# EAGLE design Adafruit Metro M0 Express (EAGLE 6.4)
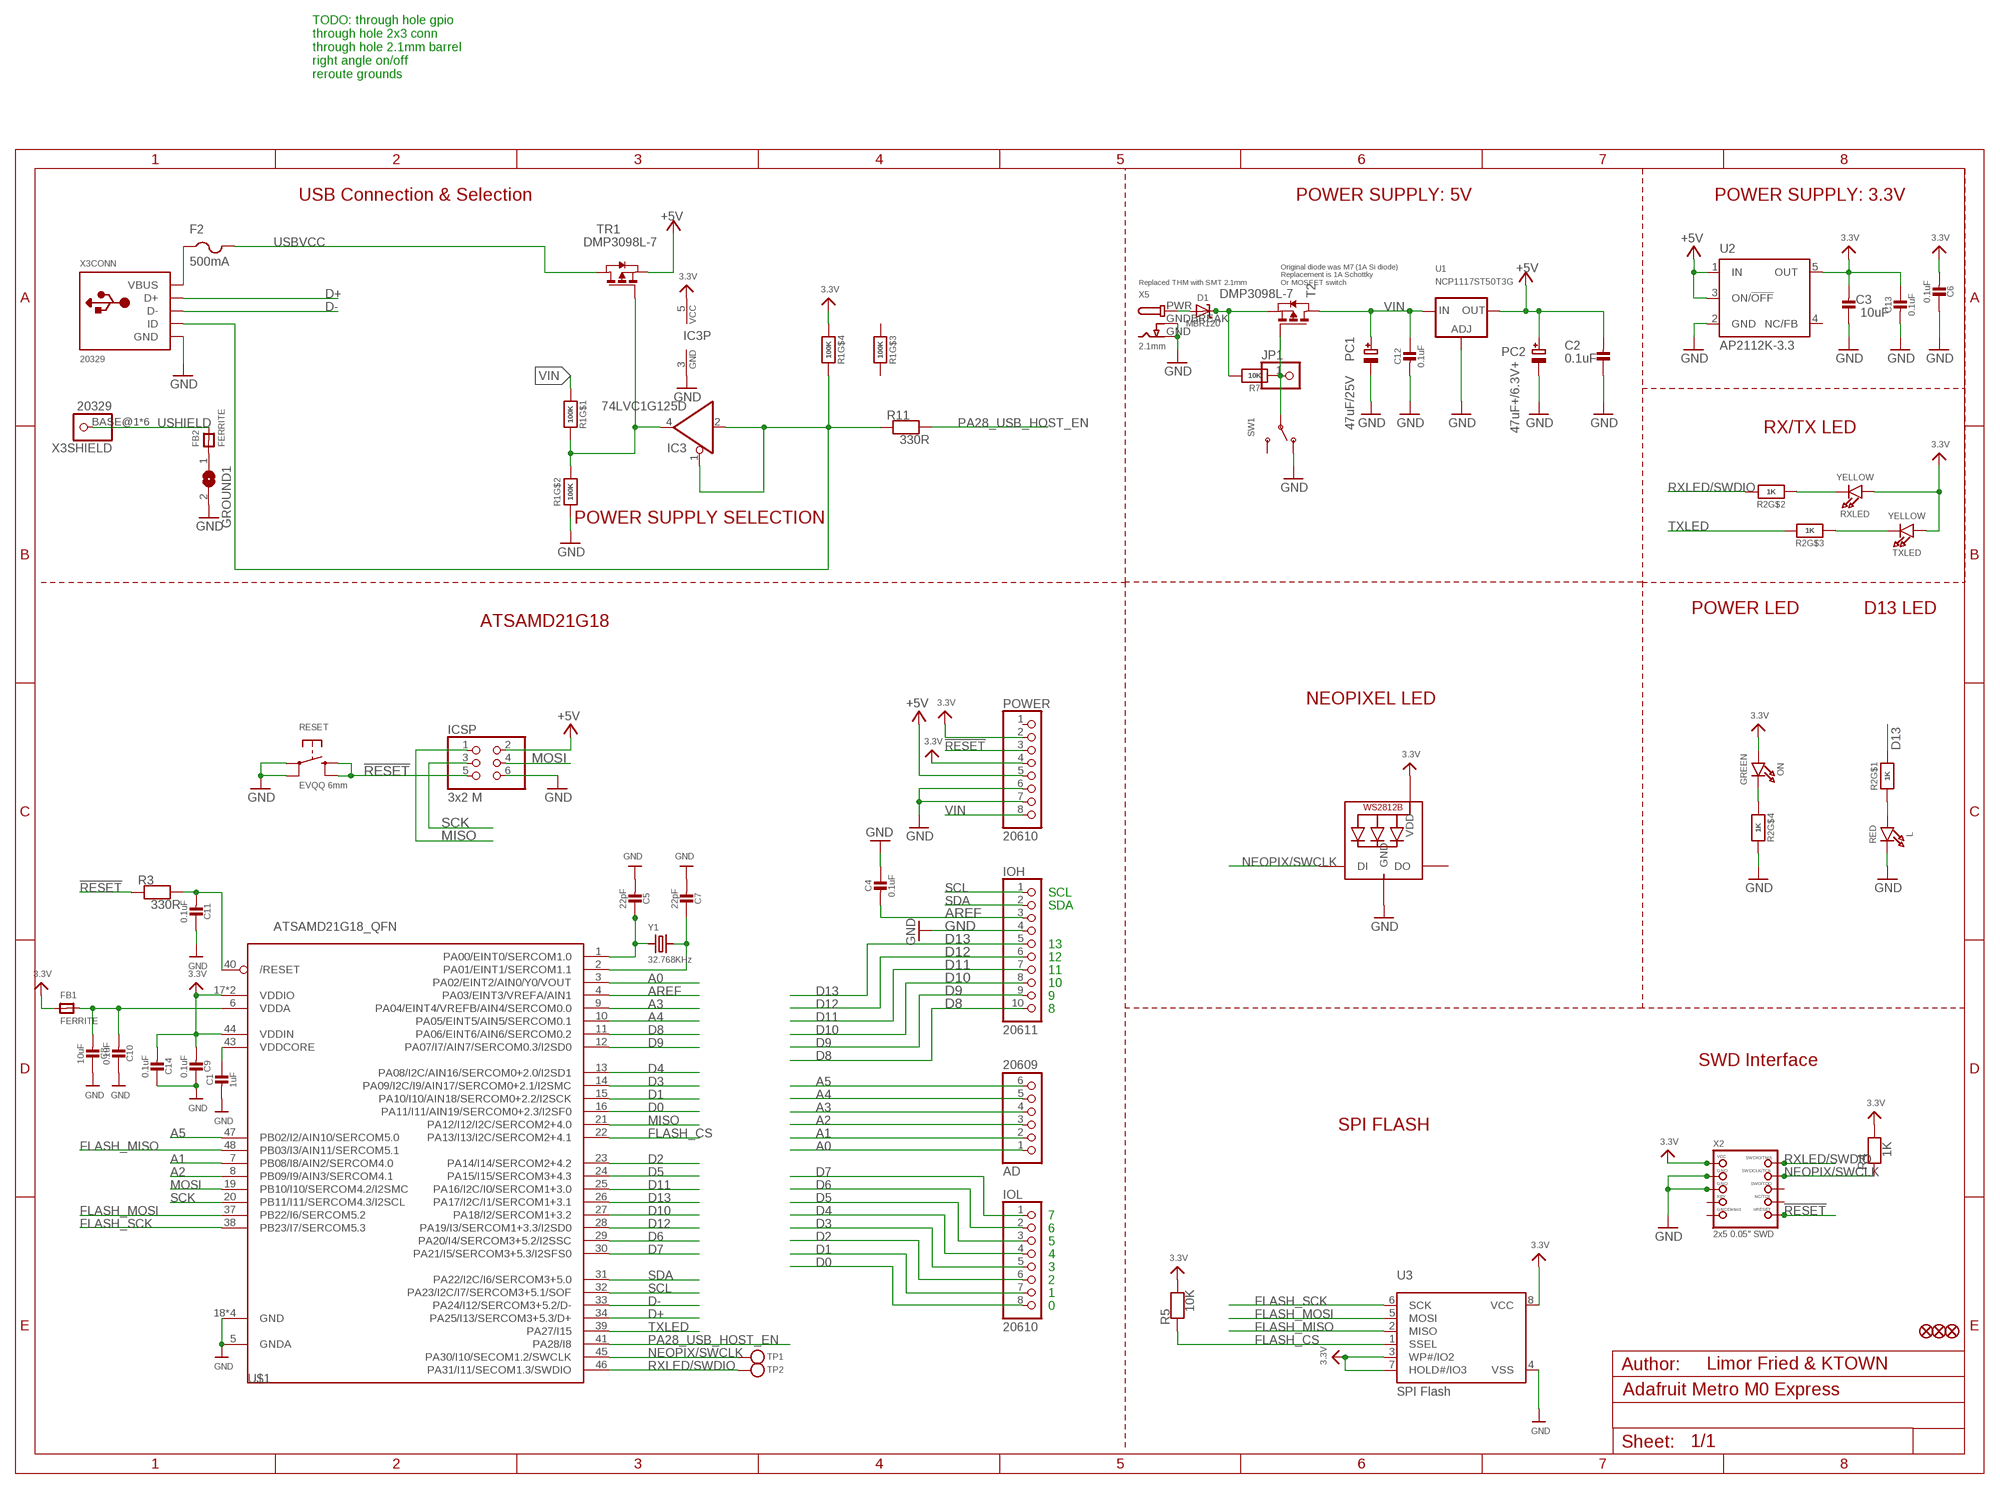
[diagram p0: schematic, sheet 1]

## Parts
AD  20609  HEADER-1X6OVALWAVE  [1X06_OVALWAVE]
C1  1uF  CAP_CERAMIC0805-NOOUTLINE  [0805-NO]
C2  0.1uF  CAP_CERAMIC0805-NOOUTLINE  [0805-NO]
C3  10uF  CAP_CERAMIC0805-NOOUTLINE  [0805-NO]
C4  0.1uF  CAP_CERAMIC0805-NOOUTLINE  [0805-NO]
C5  22pF  CAP_CERAMIC0805-NOOUTLINE  [0805-NO]
C6  0.1uF  CAP_CERAMIC0805-NOOUTLINE  [0805-NO]
C7  22pF  CAP_CERAMIC0805-NOOUTLINE  [0805-NO]
C8  10uF  CAP_CERAMIC0805-NOOUTLINE  [0805-NO]
C9  0.1uF  CAP_CERAMIC0805-NOOUTLINE  [0805-NO]
C10  0.1uF  CAP_CERAMIC0805-NOOUTLINE  [0805-NO]
C11  0.1uF  CAP_CERAMIC0805-NOOUTLINE  [0805-NO]
C12  0.1uF  CAP_CERAMIC0805-NOOUTLINE  [0805-NO]
C13  0.1uF  CAP_CERAMIC0805-NOOUTLINE  [0805-NO]
C14  0.1uF  CAP_CERAMIC0805-NOOUTLINE  [0805-NO]
D1  MBR120  DIODE-SCHOTTKYSOD-123  [SOD-123]
F2  500mA  PTCFUSE-1206  [R1206]
FB1  FERRITE  FERRITE-0805NO  [0805-NO]
FB2  FERRITE  FERRITE-0805NO  [0805-NO]
FD1  FIDUCIAL_1MM  [FIDUCIAL_1MM]
FD2  FIDUCIAL_1MM  [FIDUCIAL_1MM]
FD3  FIDUCIAL_1MM  [FIDUCIAL_1MM]
GROUND1  SJ  [SJ]
IC3  74LVC1G125D  74AHC1G125DBV  [SOT23-5]
ICSP  3x2 M  HEADER-2X3  [2X03_ROUND_70MIL]
IOH  20611  HEADER-1X10OVALWAVE  [1X10_OVALWAVE]
IOL  20610  HEADER-1X8OVALWAVE  [1X08_OVALWAVE]
JP1  HEADER-1X1ROUND  [1X01_ROUND]
L  RED  LED0805_NOOUTLINE  [CHIPLED_0805_NOOUTLINE]
LED1  WS2812B3535  [LED3535]
ON  GREEN  LED0805_NOOUTLINE  [CHIPLED_0805_NOOUTLINE]
PC1  47uF/25V  CAP_ELECTROLYTICPANASONIC_D  [PANASONIC_D]
PC2  47uF+/6.3V+  CAP_ELECTROLYTICPANASONIC_D  [PANASONIC_D]
POWER  20610  HEADER-1X8OVALWAVE  [1X08_OVALWAVE]
R1  100K  RESISTOR_4PACK  [RESPACK_4X0603]
R2  1K  RESISTOR_4PACK  [RESPACK_4X0603]
R3  330R  RESISTOR0805_NOOUTLINE  [0805-NO]
R4  1K  RESISTOR0805_NOOUTLINE  [0805-NO]
R5  10K  RESISTOR0805_NOOUTLINE  [0805-NO]
R7  10K  RESISTOR0805_NOOUTLINE  [0805-NO]
R11  330R  RESISTOR0805_NOOUTLINE  [0805-NO]
RESET  EVQQ 6mm  SWITCH_TACT_SMT  [EVQ-Q2]
RXLED  YELLOW  LED0805_NOOUTLINE  [CHIPLED_0805_NOOUTLINE]
SW1  SWITCH_SPDT  [SPDT_SMT_SSSS811101]
T2  DMP3098L-7  PMOSSOT23  [SOT-23]
TP1  TESTPOINTROUND1.5MM  [TESTPOINT_ROUND_1.5MM]
TP2  TESTPOINTROUND1.5MM  [TESTPOINT_ROUND_1.5MM]
TR1  DMP3098L-7  0297_PMV48XP  [SOT-23]
TXLED  YELLOW  LED0805_NOOUTLINE  [CHIPLED_0805_NOOUTLINE]
U1  NCP1117ST50T3G  LM1117SOT223-REFLOW  [SOT223-R]
U2  AP2112K-3.3  LP2985-XXDBVR33  [SOT23-DBV]
U3  SPI Flash  SPIFLASH_SOIC8208MIL  [SOIC8_208MIL]
U$1  ATSAMD21G18_QFN  ATSAMD21J_QFN  [TQFN48_7MM]
X2  2x5 0.05" SWD  JTAG-CORTEXBOXPOSTS  [2X05_1.27MM_BOX_POSTS]
X3  20329  USB_W_SHIELD_V2  [4UCONN_20329_V2]
X5  2.1mm  DCBARRELPTH  [DCJACK_2MM_PTH]
Y1  32.768KHz  CRYSTAL8.0X3.8  [CRYSTAL_8X3.8]

## Nets
3.3V: C3.2 C6.2 C9.2 C13.1 C14.2 FB1.1 IC3.5(VCC) LED1.2(VDD) ON.A POWER.2 POWER.4 R1.4 R4.2 R5.2 RXLED.A TXLED.A U2.5(OUT) U3.3(WP#/IO2) U3.7(HOLD#/IO3) U3.8(VCC) U$1.17(VDDIO) U$1.36(VDDIO) U$1.44(VDDIN) X2.1(VCC)
!RESET: ICSP.5 POWER.3 R3.1 RESET.B'(S1) RESET.B(S) X2.10(NRESET)
+5V [usbvcc]: C2.2 ICSP.2 PC2.+ POWER.5 TR1.2(S) U1.2(OUT) U1.4(OUT) U2.1(IN) U2.3(ON/!OFF)
A0: AD.1 U$1.3(PA02/EINT2/AIN0/Y0/VOUT)
A1: AD.2 U$1.7(PB08/I8/AIN2/SERCOM4.0)
A2: AD.3 U$1.8(PB09/I9/AIN3/SERCOM4.1)
A3: AD.4 U$1.9(PA04/EINT4/VREFB/AIN4/SERCOM0.0)
A4: AD.5 U$1.10(PA05/EINT5/AIN5/SERCOM0.1)
A5: AD.6 U$1.47(PB02/I2/AIN10/SERCOM5.0)
AREF [aref]: C4.2 IOH.3 U$1.4(PA03/EINT3/VREFA/AIN1)
AVCC: C8.2 C10.2 FB1.2 U$1.6(VDDA)
D0: IOL.8 U$1.16(PA11/I11/AIN19/SERCOM0+2.3/I2SF0)
D1: IOL.7 U$1.15(PA10/I10/AIN18/SERCOM0+2.2/I2SCK)
D2: IOL.6 U$1.23(PA14/I14/SERCOM2+4.2)
D3: IOL.5 U$1.14(PA09/I2C/I9/AIN17/SERCOM0+2.1/I2SMC)
D4: IOL.4 U$1.13(PA08/I2C/AIN16/SERCOM0+2.0/I2SD1)
D5: IOL.3 U$1.24(PA15/I15/SERCOM3+4.3)
D6: IOL.2 U$1.29(PA20/I4/SERCOM3+5.2/I2SSC)
D7: IOL.1 U$1.30(PA21/I5/SERCOM3+5.3/I2SFS0)
D8: IOH.10 U$1.11(PA06/EINT6/AIN6/SERCOM0.2)
D9: IOH.9 U$1.12(PA07/I7/AIN7/SERCOM0.3/I2SD0)
D10: IOH.8 U$1.27(PA18/I2/SERCOM1+3.2)
D11: IOH.7 U$1.25(PA16/I2C/I0/SERCOM1+3.0)
D12: IOH.6 U$1.28(PA19/I3/SERCOM1+3.3/I2SD0)
D13: IOH.5 R2.8 U$1.26(PA17/I2C/I1/SERCOM1+3.1)
D+: U$1.34(PA25/I13/SERCOM3+5.3/D+) X3.D+(CONN:D+)
D-: U$1.33(PA24/I12/SERCOM3+5.2/D-) X3.D-(CONN:D-)
FLASH_CS: R5.1 U3.1(SSEL) U$1.22(PA13/I13/I2C/SERCOM2+4.1)
FLASH_MISO: U3.2(MISO) U$1.48(PB03/I3/AIN11/SERCOM5.1)
FLASH_MOSI: U3.5(MOSI) U$1.37(PB22/I6/SERCOM5.2)
FLASH_SCK: U3.6(SCK) U$1.38(PB23/I7/SERCOM5.3)
GND [gnd]: C1.2 C2.1 C3.1 C4.1 C5.2 C6.1 C7.2 C8.1 C9.1 C10.1 C11.1 C12.2 C13.2 C14.1 GROUND1.2 IC3.3(GND) ICSP.6 IOH.4 L.C LED1.4(GND) PC1.- PC2.- POWER.6 POWER.7 R1.2 R2.5 RESET.A'(P1) RESET.A(P) SW1.A(O) U1.1(ADJ) U2.2(GND) U3.4(VSS) U$1.5(GNDA) U$1.18(GND) U$1.35(GND) U$1.42(GND) U$1.THERMAL(GND) X2.3(GND) X2.5(GND) X3.GND(CONN:GND) X5.GND X5.GNDBREAK
MISO: ICSP.1 U$1.21(PA12/I12/I2C/SERCOM2+4.0)
MOSI: ICSP.4 U$1.19(PB10/I10/SERCOM4.2/I2SMC)
N$1: L.A R2.1
N$2: FB2.1 GROUND1.1
N$3: ON.C R2.4
N$4: C5.1 U$1.1(PA00/EINT0/SERCOM1.0) Y1.P$1
N$5: R2.2 RXLED.C
N$6: C7.1 U$1.2(PA01/EINT1/SERCOM1.1) Y1.P$4
N$7: R2.3 TXLED.C
N$8: C11.2 R3.2 U$1.40(/RESET)
N$9: D1.A X5.PWR
N$10: IC3.1(OE) IC3.2(I) R1.5 R11.1 X3.ID(CONN:ID)
N$11: IC3.4(O) R1.7 R1.8 TR1.3(G)
N$13: JP1.1 R7.1 SW1.B(P) T2.3(G)
N$15: D1.C R7.2 T2.2(S)
NEOPIX/SWCLK: LED1.1(DI) R4.1 TP1.P$1 U$1.45(PA30/I10/SECOM1.2/SWCLK) X2.4(SWDCLK)
PA28_USB_HOST_EN: R11.2 U$1.41(PA28/I8)
RXLED/SWDIO: R2.7 TP2.P$1 U$1.46(PA31/I11/SECOM1.3/SWDIO) X2.2(SWDIO)
SCK: ICSP.3 U$1.20(PB11/I11/SERCOM4.3/I2SCL)
SCL: IOH.1 U$1.32(PA23/I2C/I7/SERCOM3+5.1/SOF)
SDA: IOH.2 U$1.31(PA22/I2C/I6/SERCOM3+5.0)
TXLED: R2.6 U$1.39(PA27/I15)
USBVCC [usbvcc]: F2.2 TR1.1(D)
USHIELD [gnd]: FB2.2 X3.BASE@1 X3.BASE@2 X3.SPRT@1 X3.SPRT@2 X3.SPRT@3 X3.SPRT@4
VBUS: F2.1 X3.VBUS(CONN:VBUS)
VDDCORE: C1.1 U$1.43(VDDCORE)
VIN [USB]: C12.1 PC1.+ POWER.8 R1.1 T2.1(D) U1.3(IN)
Unconnected: LED1.3(DO) POWER.1 R1.3 R1.6 SW1.C(S) U2.4(NC/FB) X2.6(SWO) X2.7(KEY) X2.8(TDI) X2.9(GNDDETECT)

## Notes on the sheet
- TODO: through hole gpio
  through hole 2x3 conn
  through hole 2.1mm barrel
  right angle on/off
  reroute grounds
- USB Connection & Selection | POWER SUPPLY: 5V | POWER SUPPLY: 3.3V
- Replaced THM with SMT 2.1mm
- Original diode was M7 (1A Si diode)
  Replacement is 1A Schottky
  Or MOSFET switch
- RX/TX LED
- POWER SUPPLY SELECTION
- POWER LED | D13 LED
- ATSAMD21G18
- NEOPIXEL LED
- SCL
- SDA
- 13
- 12
- 11
- 10
- 9
- 8
- SWD Interface
- SPI FLASH
- 7
- 6
- 5
- 4
- 3
- 2
- 1
- 0
- Limor Fried & KTOWN

## Library data of the parts
AD = microbuilder:HEADER-1X6: PIN HEADER
C1-C14 = microbuilder:CAP_CERAMIC: Ceramic Capacitors For new designs, use the packages preceded by an '_' character since they are more reliable: The following footprints should be used on most boards: _0402 - Standard footprint for regular board layouts _0603 - Standard footprint for regular board layouts _0805 - Standard footprint for regular board layouts _1206 - Standard footprint for regular board layouts For extremely tight-pitch boards where space is at a premium, the following 'micro-pitch' footprints can be used (smaller pads, no silkscreen outline, etc.): _0402MP - Micro-pitch footprint for very dense/compact boards _0603MP - Micro-pitch footprint for very dense/compact boards _0805MP - Micro-pitch footprint for very dense/compact boards _1206MP - Micro-pitch footprint for very dense/compact boards
D1 = microbuilder:DIODE-SCHOTTKY
F2 = adafruit:PTCFUSE: PTC fuses, resettable thermistors
FB1 FB2 = microbuilder:FERRITE: Ferrite Bead 0603 MMZ1608B121C - 120 Ohm @ 100MHz, 600mA, 0.15 Ohm DC Resistance - Digikey: 445-2164-1-ND BK1608HW121-T - 120 Ohm, 600mA Ferrite Chip - Digikey: 587-1876-2-ND 0805 HZ0805B272R-10 - 2.7K Ohm @ 100MHz, 200mA, 0.8 Ohm DC Resistance - Digikey: 240-2504-1-ND (see also Murata BLM21BD272SN1L) MMZ2012Y152B - 1.5K Ohm @ 100MHz, 500mA, 0.4 Ohm DC Resistance - Digikey: 445-1560-1-ND - Mainly for high frequency (80-400MHz) MMZ2012R102A - 1K Ohm @ 100MHz, 500mA, 0.3 Ohm DC Resistance - Digikey: 445-1555-2-ND - More general purpose (10-200MHz)
FD1-FD3 = microbuilder:FIDUCIAL: Fiducial Alignment Points Various fiducial points for machine vision alignment.; BOM: EXCLUDE
GROUND1 = jumper:SJ: SMD solder JUMPER
IC3 = 74xx-little-de:74*1G125: Single Bus Buffer Gate with 3-State Output
ICSP = microbuilder:HEADER-2X3: PIN HEADER
IOH = microbuilder:HEADER-1X10: PIN HEADER
IOL POWER = microbuilder:HEADER-1X8: PIN HEADER
JP1 = microbuilder:HEADER-1X1: PIN HEADER
L ON RXLED TXLED = microbuilder:LED: LED 0603 - 0603 Surface Mount Package 2mA: Green LED - Low Power (3.9mcd, 2ma, 1.7Vf) - Digikey: 475-2709-2-ND Orange LED - Low Power (9.8mcd, 2ma, 1.8Vf) - Digikey: 475-1194-2-ND Red LED - Low Power (5mcd, 2ma, 1.8Vf) - Digikey: 475-1195-2-ND Yellow LED - Low Power (7mcd, 2ma, 1.8Vf) - Digikey: 475-1196-2-ND 5mA: Blue LED - Low Power (17mcd, 5ma, 2.9Vf) - Digikey: LNJ937W8CRACT-ND 0805 - 0805 Surface Mount Package 2mA: Red LED (8.8mcd, 2mA, 1.8Vf, Clear) - Low Power [Digikey: 475-2510-1-ND] Green LED (5mcd, 2mA, 1.8Vf, Clear) - Low Power [Digikey: 475-2730-1-ND] Yellow LED (11.3mcd, 2mA, 1.8Vf, Clear) - Low Power [Digikey: 475-2555-1-ND] 20mA: Red LED (104mcd, 20mA, Diffused) - LS R976 [Digikey: 475-1278-6-ND] Red LED (12mcd, 20mA, 2.0Vf, Clear) - APT2012EC [Digikey: 754-1128-1-ND] Green LED (15mcd, 20mA, 2.2Vf, Clear) - APT2012GC [Digikey: 754-1131-1-ND] Orange LED (160mcd, 20mA, 2.1Vf, Clear) - APT2012SECK [Digikey: 754-1130-1-ND] 1206 - 1206 Surface Mount Package Green LED (26mcd, 20mA, Diffused) - LG N971 [Digikey: 475-1407-6-ND] Red LED (15mcd, 20mA, Diffused) - LH N974 [Digikey: 475-1416-6-ND] Cree - Cree High-Power Surface Mount LEDs XPEBWT-L1-0000-00D50 - White 111lm 350mA 2.9Vf 6200K 110° XTEAWT-00-0000-00000LEE3 - White 114lm 350mA 2.85Vf 5000K 115° Everlight - Everlight 45-21 Series Surface Mount LEDs 45-21/QK2C-B2832AC2CB2/2T - Warm White 2000mcd 20mA 3.25Vf 3050K 120° 45-21/LK2C-B38452C4CB2/2T - Nuetral White 2000mcd 20mA 3.25Vf 4150K 120° 45-21/LK2C-B50634C6CB2/2T - Cold White 2200mcd 20mA 3.25Vf 5650K 120° PLCC2 Reverse Mount LS T77K-J1L2-1-0-2-R18-Z - Red 11.25mcd 2mA 1.8Vf 630nm 120° LO T77K-L1M2-24-Z - Orange 19.6mcd 2mA 1.8Vf 606nm 120° LY T77K-K2M1-26-Z - Yellow 15.7mcd 2mA 1.8Vf 587nm 120°
LED1 = microbuilder:WS2812B
PC1 PC2 = microbuilder:CAP_ELECTROLYTIC: Electrolytic Capacitors SMT PANASONIC_C - Size C Panasonic Electrolytic Aluminum Capacitor 47µF 16V 20% Electrolytic Capacitor [Digikey: PCE3890TR-ND] PANASONIC_D - Size D Panasonic Electrolytic Aluminum Capacitor 100µF 25V 20% Electrolytic Capacitor [Digikey: PCE3898TR-ND] PTH 3.5 mm grid, 8 mm diameter ... 3.5 mm grid, 10 mm diameter ...
R1 R2 = microbuilder:RESISTOR_4PACK: Resistor Packs (4 resistors) 4 x 0603 10K 1/16W - Digikey: YC164J-10KCT-ND
R3-R5 R7 R11 = microbuilder:RESISTOR: Resistors For new designs, use the packages preceded by an '_' character since they are more reliable: The following footprints should be used on most boards: _0402 - Standard footprint for regular board layouts _0603 - Standard footprint for regular board layouts _0805 - Standard footprint for regular board layouts _1206 - Standard footprint for regular board layouts For extremely tight-pitch boards where space is at a premium, the following 'micro-pitch' footprints can be used (smaller pads, no silkscreen outline, etc.): _0402MP - Micro-pitch footprint for very dense/compact boards _0603MP - Micro-pitch footprint for very dense/compact boards _0805MP - Micro-pitch footprint for very dense/compact boards _1206MP - Micro-pitch footprint for very dense/compact boards
RESET = microbuilder:SWITCH_TACT_SMT: SMT Tact Switches 6x6mm - Digikey: P12940SCT-ND KMR2 (4.6x2.8mm) - Digikey: 401-1426-1-ND EVQ-PQHB55 - Light Touch, 160GF (4.5x4.5mm) - Digikey: P8090SCT-ND KMT0 - KMT021 NGJ LHS (etc.) IP68/Waterproof - Digikey: CKN10289CT-ND
SW1 = microbuilder:SWITCH_SPDT: Switch - SPDT SSSS811101 - Horizontal Two Position SMT, 0.3A 4V [Mouser: 688-SSSS811101]
T2 = zetex:PMOSSOT23: MOS FET; OC_FARNELL: unknown; OC_NEWARK: unknown
TP1 TP2 = microbuilder:TESTPOINT: Test Point Various test points for characterisation and PCB testing TESTPOINT_SMT - Compact Surface Mount Test Point [Digikey: 5016KTR-ND]
TR1 = Transistors:0297_PMV48XP: 20 V, 3.5 A P-channel Trench MOSFET - PMV48XP; CASE: SOT23; MONTHLY_USAGE: _____; PART_NUMBER: PMV48XP; PRICE: _____; SUPPLIER: _____; TYPE: Transistor; VALUE: PMV48XP
U1 = microbuilder:LM1117: LM1117 Voltage Regulator LM1117 Adjustable Voltage regulator [Digikey: LM1117IMP-ADJDKR-ND] LM1117 3.3V Voltage regulator [AP1117E33GDIDKR-ND] LM1117 5.0V Voltage regulator [AP1117E50GDIDKR-ND] SOT223-REFLOW - SOT223 package for solder paste/reflow ovens SOT223-WAVE - SOT223 package for hand-soldering (larger pads) Note: For the fixed-voltage regulators, simply set the ADJ pin to GND.
U2 = SmartPrj:LP2985-XXDBVR: ULTRALOW-POWER 50-mA LOW-DROPOUT LINEAR REGULATORS 50-mA Low-Dropout Regulator Source: http://focus.ti.com/lit/ds/symlink/tps77001.pdf
U3 = microbuilder:SPIFLASH_SOIC8: SOIC8 SPI Flash Be careful with the size since SOIC8 flash comes in several 'widths' SOIC8 150 mil M25P16 - 16Mbit (2Mbit x 8) Serial Flash (75MHz SPI Bus), Supply: 2.7-3.6V Digikey: SOIC8 - M25P16-VMN6P-ND SOIC8 208 mil W25Q16BVSSIG - 16Mbit (2Mbit x 8) Serial Flash (104MHz SPI Bus), Supply: 2.7-3.6V Digikey: SOIC8 - W25Q16BVSSIG-ND
U$1 = microbuilder:ATSAMD21J
X2 = microbuilder:JTAG-CORTEX: Serial Wire (SW-DP) Connector Standard 0.05" 10-pin connector is for use with the Cortex M and Cortex A SWD (serial wire debugger) interface (SW-DP) Connectors 2x05_1.27MM_SMT - Inexpensive surface-mount header with bare pins, compatible with standard 10-pin SWD cables (4UCON: 16846) 2x05_1.27MM_BOX_NOPOSTS - Polarised surface-mount box (4UCON with caps: 19735, without caps: 15117 2x05_1.27MM_BOX_POSTS - Polarised surface-mount box with mounting holes (4UCON: 20317) Pinout: http://infocenter.arm.com/help/topic/com.arm.doc.faqs/attached/13634/cortex_debug_connectors.pdf http://www.keil.com/peripherals/coresight/connectors.asp
X3 = microbuilder:USB_W_SHIELD
X5 = microbuilder:DCBARREL: DC Barrel Jack DCJACK_1.3MM_PTH - Through Hole 1.3mm Jack (4UConnector: 05536) DCJACK_2MM_PTH - Through Hole 2.0/2.1 Jack (4UConnector: 05537) DCJACK_2MM_SMT - SMT 2.0/2.1mm Jack(4UConnector: 03267)
Y1 = microbuilder:CRYSTAL: Crystals HC49UP - Surface Mount Crystal 4.0MHz 18pF +/-30ppm Surface Mount Crystal [Digikey: 535-9857-1-ND] 12.0 MHz Surface Mount Crystal [Digikey: 535-9869-6-ND] 25.0 MHz Surface Mount Crystal [Digikey: 535-9078-1-ND] 2.5 x 2.0mm - MEMs SMT Crystal 16.0 MHz 10pF 20ppm 2.5 x 2.0mm Crystal [Digikey -40-85°C: 535-10923-1-ND] 3.2 x 2.5mm - MEMs SMT Crystal 12.0 MHz 8pF 15ppm 3.2 x 2.5mm Crystal [Digikey: -10-70°C: 644-1047-1-ND -40-125°C: 644-1128-1-ND] 40~85°C cheaper: 644-1173-6-ND 16.0 MHz 8pF 15ppm 3.2 x 2.5mm Crystal [Digikey: -10-70°C: 644-1049-1-ND -40-125°C: 644-1129-2-ND]-40~85°C cheaper: 644-1175-6-ND 16.0 MHz 10pF 10ppm 3.2 x 2.5mm Crystal [Digikey: 644-1100-1-ND] 27.12 MHz 18pF 30ppm 3.2 x 2.5mm Crystal [Digikey: 887-1424-1-ND] 27.12MHz 10pF 10ppm 3.2 x 2.5mm Crystal [Digikey: 887-1329-1-ND] 4.9 x 1.8mm - MEMs SMT Crystal 32.768 KHz 12.5pF 20ppm 4.9 x 1.8mm Crystal [Digikey: SE2415CT-ND] 8.0 x 3.8mm - Surface Mount Crystal 32.768kHz 12.5pF 20ppm -40°C-85°C [Digikey: 535-9166-2-ND] Cylinder 32.768KHz Cylinder Crystal (2x6mm body) [Ex. Digikey: 300-8341-2-ND]

## Board
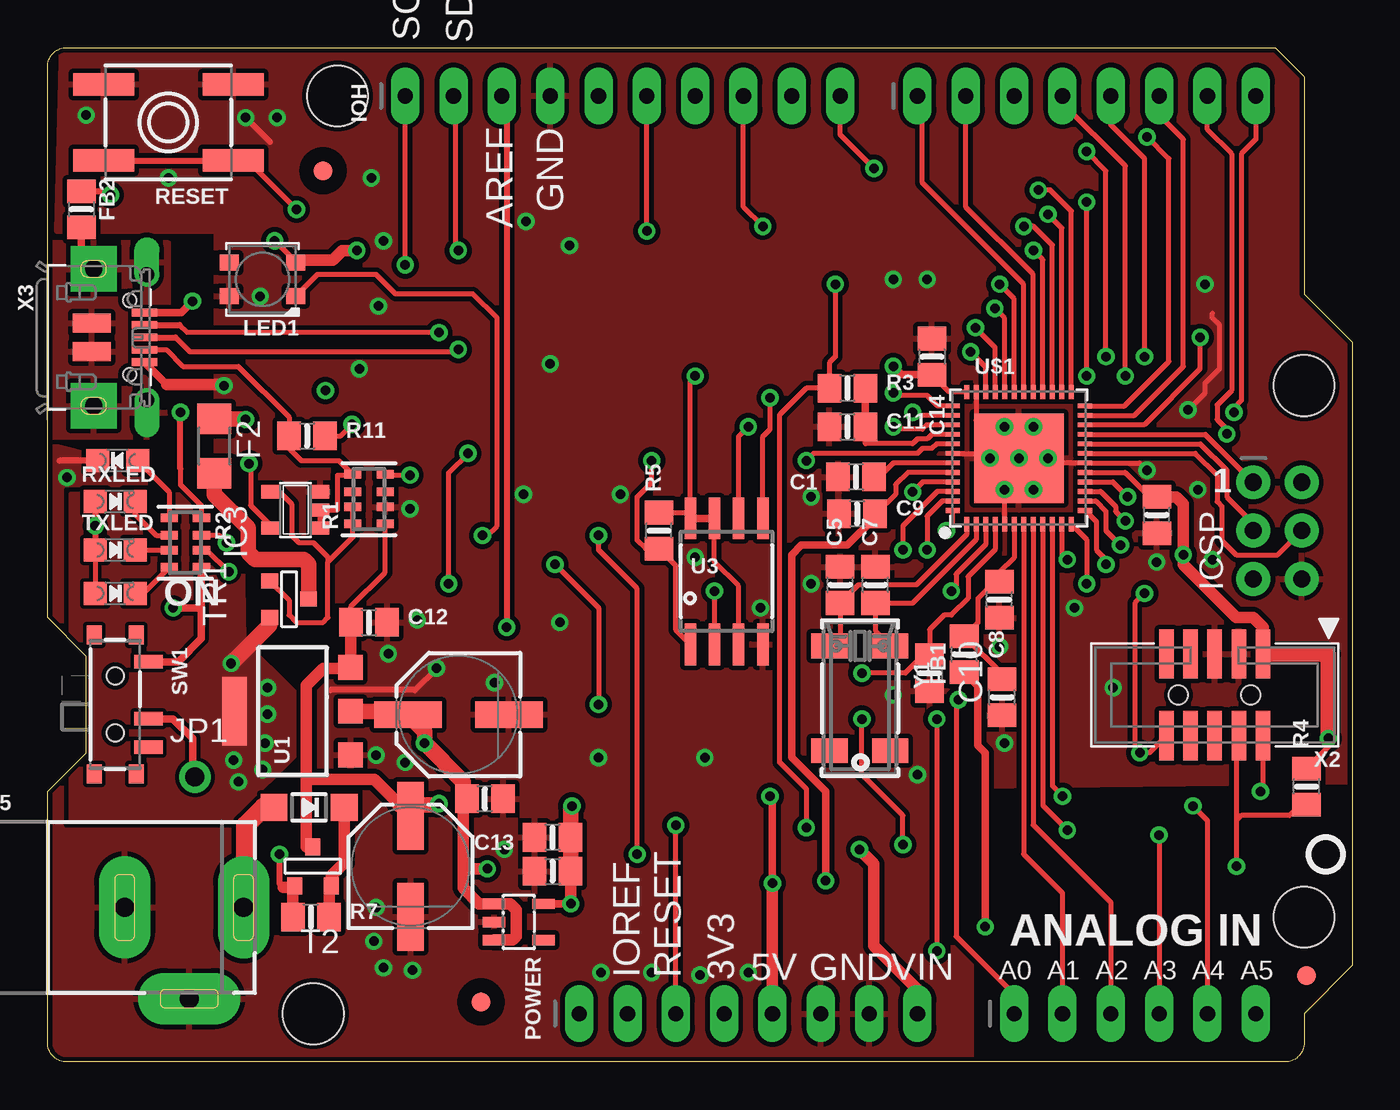
[diagram p1: board, top side]
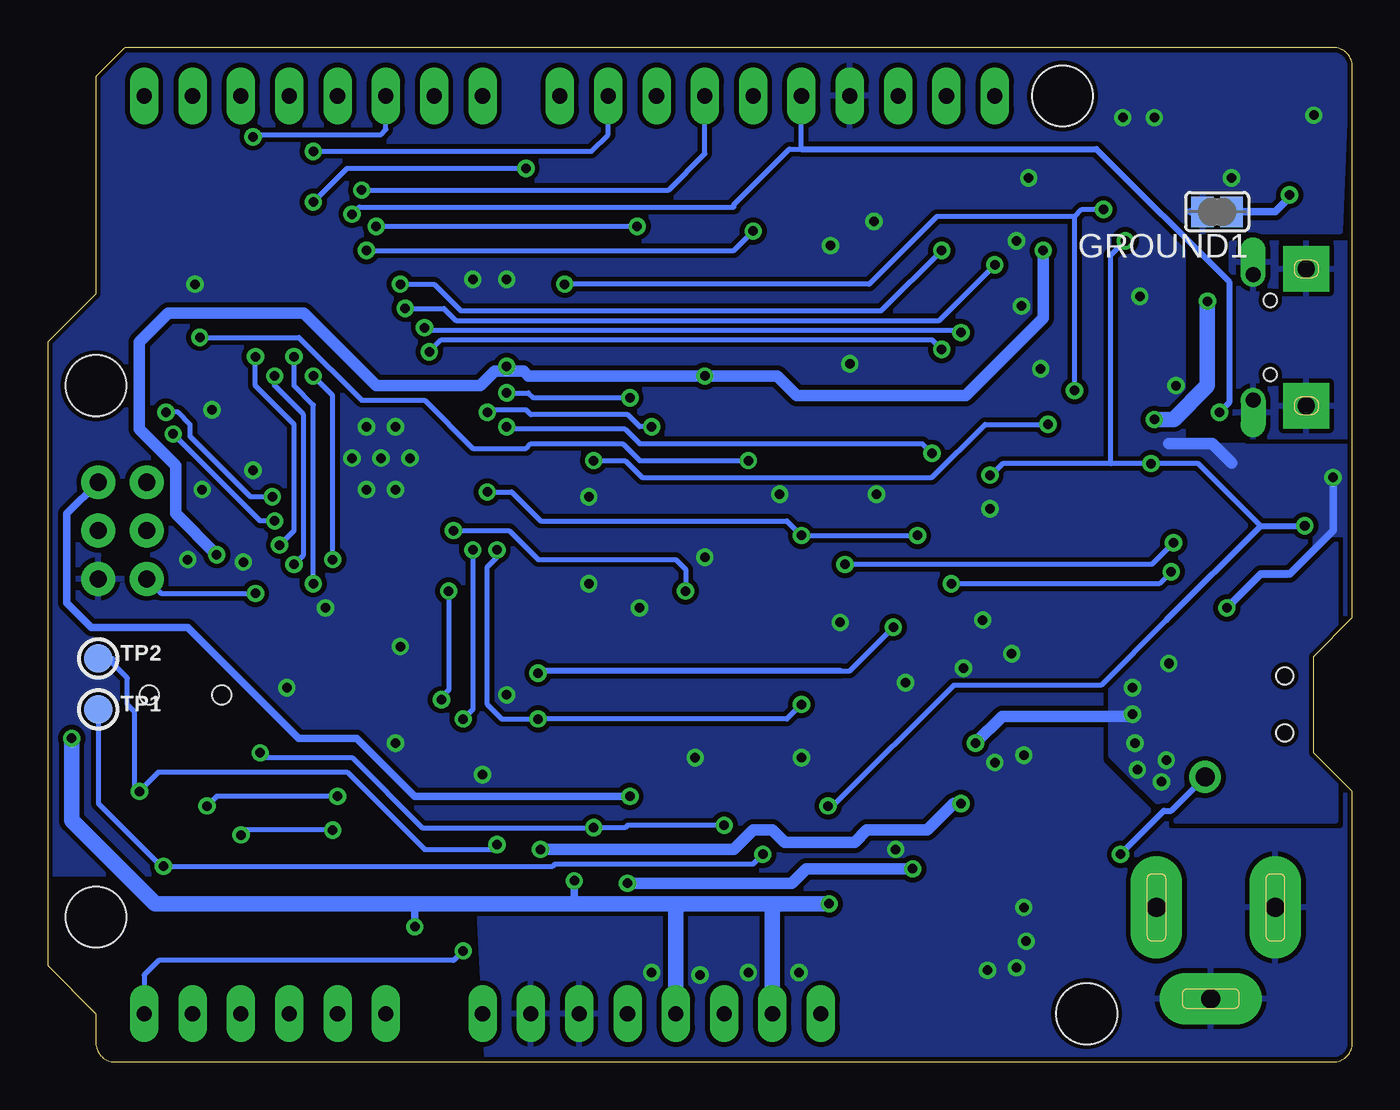
[diagram p2: board, bottom side, seen from below]

Size 68.58 x 53.34 mm. Coordinates in mm from the lower left corner, seen from the top.
Outline: 64.52,53.34 66.04,51.82 66.04,40.39 68.58,37.85 68.58,5.08 66.04,2.54 66.04,1 arc-90 65.04,0 1,0 arc-90 0,1 0,14.22 2.03,16.26 2.03,21.34 0,23.37 0,52.34 arc-90 1,53.34 64.52,53.34
Copper layers (1*16): Top 0.035mm / dielectric 1.5mm / Bottom 0.035mm
Design rules "adafruit *": minimum track width 8mil, minimum drill 15.5mil, track to track 8mil, track to pad 8mil, pad to pad 8mil, via to via 8mil, smd to smd 8mil, copper to edge 10mil, drill to drill 8mil, minimum pad ring 10mil, minimum via ring 8mil, stop-mask expansion 2mil, vias tented up to drill 20mil, thermal gap 10mil
Holes 3.2 mm at 66.04,35.56 66.04,7.62 15.24,50.8 13.97,2.54

### Footprints (pad centres in the part's own frame; a part is rotated, then mirrored left to right if it is on the bottom)
1X06_OVALWAVE = drill 0.8 pad 1.5 long: 1 -6.35,0; 2 -3.81,0; 3 -1.27,0; 4 1.27,0; 5 3.81,0; 6 6.35,0
0805-NO = smd 1.24 x 1.5: 1 -0.95,0; 2 0.95,0
SOD-123 = smd 1.4 x 1.4: A 1.85,0; C -1.85,0
R1206 = smd 1.6 x 1.803: 1 -1.422,0; 2 1.422,0
FIDUCIAL_1MM = smd 1 x 1: 1 0,0
SJ = smd 1.168 x 1.6: 1 -0.762,0; 2 0.762,0
SOT23-5 = smd 0.69 x 0.99: 1 -0.95,-1.29; 2 0,-1.29; 3 0.95,-1.29; 4 0.95,1.3; 5 -0.95,1.3
2X03_ROUND_70MIL = drill 0.9 pad 1.778: 1 -2.54,-1.27; 2 -2.54,1.27; 3 0,-1.27; 4 0,1.27; 5 2.54,-1.27; 6 2.54,1.27
1X10_OVALWAVE = drill 0.8 pad 1.5 long: 1 -11.43,0; 2 -8.89,0; 3 -6.35,0; 4 -3.81,0; 5 -1.27,0; 6 1.27,0; 7 3.81,0; 8 6.35,0; 9 8.89,0; 10 11.43,0
1X08_OVALWAVE = drill 0.8 pad 1.5 long: 1 -8.89,0; 2 -6.35,0; 3 -3.81,0; 4 -1.27,0; 5 1.27,0; 6 3.81,0; 7 6.35,0; 8 8.89,0
1X01_ROUND = drill 1 pad 1.676: 1 0,0
CHIPLED_0805_NOOUTLINE = smd 1.2 x 1.2: A 0,-1.05; C 0,1.05
LED3535 = smd 1 x 0.85: 1 -1.75,0.875; 2 -1.75,-0.875; 3 1.75,-0.875; 4 1.75,0.875
PANASONIC_D = smd 3.556 x 1.4: + 2.654,0; - -2.654,0
RESPACK_4X0603 = smd 0.45 x 0.9: 1 -1.3,-0.85; 2 -0.4,-0.85; 3 0.4,-0.85; 4 1.3,-0.85; 5 1.3,0.85; 6 0.4,0.85; 7 -0.4,0.85; 8 -1.3,0.85
EVQ-Q2 = smd 3.2 x 1.2: A -3.4,-2; A' 3.4,-2; B -3.4,2; B' 3.4,2
SPDT_SMT_SSSS811101 = smd 0.7 x 1.5: A -2.25,1.75; B 0.75,1.75; C 2.25,1.75 | smd 1 x 0.8: SUP1 -3.65,1.1; SUP2 -3.65,-1.1; SUP3 3.65,1.1; SUP4 3.65,-1.1 | hole 0.9: -1.5,0; 1.5,0
SOT-23 = smd 0.787 x 0.889: 1 0.025,-1.016; 2 -0.94,1.016; 3 0.991,1.016
TESTPOINT_ROUND_1.5MM = smd 1.5 x 1.5: P$1 0,0
SOT223-R = smd 1.3 x 1.3: 1 -2.3,-3.05; 2 0,-3.05; 3 2.3,-3.05 | smd 3.6 x 1.3: 4 0,3.05
SOT23-DBV = smd 0.55 x 1.2: 1 -0.95,-1.3; 2 0,-1.3; 3 0.95,-1.3; 4 0.95,1.3; 5 -0.95,1.3
SOIC8_208MIL = smd 0.6 x 2.2: 1 -1.905,-3.315; 2 -0.635,-3.315; 3 0.635,-3.315; 4 1.905,-3.315; 5 1.905,3.315; 6 0.635,3.315; 7 -0.635,3.315; 8 -1.905,3.315
TQFN48_7MM = smd 0.25 x 0.75: 1 -2.75,-3.475; 2 -2.25,-3.475; 3 -1.75,-3.475; 4 -1.25,-3.475; 5 -0.75,-3.475; 6 -0.25,-3.475; 7 0.25,-3.475; 8 0.75,-3.475; 9 1.25,-3.475; 10 1.75,-3.475; 11 2.25,-3.475; 12 2.75,-3.475; 25 2.75,3.475; 26 2.25,3.475; 27 1.75,3.475; 28 1.25,3.475; 29 0.75,3.475; 30 0.25,3.475; 31 -0.25,3.475; 32 -0.75,3.475; 33 -1.25,3.475; 34 -1.75,3.475; 35 -2.25,3.475; 36 -2.75,3.475 | smd 0.75 x 0.25: 13 3.475,-2.75; 14 3.475,-2.25; 15 3.475,-1.75; 16 3.475,-1.25; 17 3.475,-0.75; 18 3.475,-0.25; 19 3.475,0.25; 20 3.475,0.75; 21 3.475,1.25; 22 3.475,1.75; 23 3.475,2.25; 24 3.475,2.75; 37 -3.475,2.75; 38 -3.475,2.25; 39 -3.475,1.75; 40 -3.475,1.25; 41 -3.475,0.75; 42 -3.475,0.25; 43 -3.475,-0.25; 44 -3.475,-0.75; 45 -3.475,-1.25; 46 -3.475,-1.75; 47 -3.475,-2.25; 48 -3.475,-2.75 | smd 4.7 x 4.7: THERMAL 0,0
2X05_1.27MM_BOX_POSTS = smd 0.76 x 2.6: 1 -2.54,-2.15; 2 -2.54,2.15; 3 -1.27,-2.15; 4 -1.27,2.15; 5 0,-2.15; 6 0,2.15; 7 1.27,-2.15; 8 1.27,2.15; 9 2.54,-2.15; 10 2.54,2.15 | hole 1: -1.905,0; 1.905,0
4UCONN_20329_V2 = smd 1 x 2: BASE@1 -0.75,-2; BASE@2 0.75,-2 | smd 0.4 x 1.35: D+ 0,0.775; D- -0.65,0.775; GND 1.3,0.775; ID 0.65,0.775; VBUS -1.3,0.775 | drill 0.8 pad 1.143 offset: SPRT@1 -3.3,0.9; SPRT@2 3.3,0.9 | drill 0.9 pad 2.413 square: SPRT@3 -3.6,-1.9; SPRT@4 3.6,-1.9 | hole 0.7: -1.95,0; 1.95,0
DCJACK_2MM_PTH = drill 1 pad 2.7 long: GND 7.35,0; GNDBREAK 10.75,-4.8; PWR 13.6,0
CRYSTAL_8X3.8 = smd 1.3 x 1.9: P$1 -2.75,-1.6; P$2 2.75,-1.6; P$3 2.75,1.6; P$4 -2.75,1.6

### Placement (x,y rotation side)
AD  57.15,2.54 0 top
C1  42.49,30.76 180 top
C2  22.99,13.84 180 top
C3  26.54,10.03 0 top
C4  46.35,20.45 90 top
C5  41.66,25.08 90 top
C6  58.3,28.76 90 top
C7  43.51,25.08 90 top
C8  50.16,19.18 90 top
C9  42.55,28.83 0 top
C10  50.02,24.31 90 top
C11  42.04,33.4 0 top
C12  16.89,23.11 0 top
C13  26.54,11.81 180 top
C14  46.48,37.08 270 top
D1  13.74,13.39 180 top
F2  8.76,32.38 270 top
FB1  48.18,21.43 90 top
FB2  1.78,44.83 270 top
FD1  14.48,46.86 0 top
FD2  66.16,4.55 0 top
FD3  22.78,3.16 0 top
GROUND1  7.11,44.7 180 bottom
IC3  13.03,29.03 90 top
ICSP  64.64,27.94 270 top
IOH  30.23,50.8 0 top
IOL  54.61,50.8 0 top
JP1  7.75,14.99 0 top
L  3.68,31.62 90 top
LED1  11.3,41.15 180 top
ON  3.56,24.64 270 top
PC1  19.08,10.29 90 top
PC2  21.59,18.26 180 top
POWER  36.83,2.54 0 top
R1  16.89,29.59 90 top
R2  7.24,27.3 270 top
R3  42.04,35.43 0 top
R4  66.17,14.48 90 top
R5  32.13,27.94 90 top
R7  13.84,7.62 0 top
R11  13.64,32.92 0 top
RESET  6.35,49.4 180 top
RXLED  3.56,29.46 270 top
SW1  3.56,18.8 270 top
T2  13.97,10.29 180 top
TP1  65.91,18.54 0 bottom
TP2  65.91,21.21 0 bottom
TR1  12.7,24.31 90 top
TXLED  3.56,26.92 270 top
U1  12.88,18.44 90 top
U2  24.77,7.37 270 top
U3  35.69,25.27 0 top
U$1  51.05,31.75 0 top
U$11  [METRO_M0_BACK]  68.58,0 0 bottom
U$14  [PCBFEAT-REV-040]  67.18,10.92 0 top
U$30  [METRO_M0_FRONT]  0,0 0 top
X2  61.34,19.3 180 top
X3  4.32,38.1 270 top
X5  -3.3,8.13 0 top
Y1  42.7,19.13 270 top

### Tracks (layer width: path | path; a pad name or v marks a point on that pad's centre or on a via)
3.3V  (via drill 0.5)
  Top 0.254: v27.56,13.46 27.62,13.4 | TXLED.A ON.A | R1.4 17.81,30.89 17.84,30.86 v19.05,30.86 | IC3.5 11.73,28.21 10.67,29.27 10.67,31.38 v10.58,31.46 | v11.94,43.18 13.04,42.08 13.04,42.04 LED1.2 13.07,42.02 13.21,42.16 | U$1.17 56.63,31 57.92,29.71 C6.2 | U$1.44 45.22,31 44.58,30.35 44.58,29.84 43.56,28.83 C9.2 | U$1.36 47.39,35.23 C14.2 | v67.31,17.02 67.31,16.57 R4.2 | U3.3 36.32,25.02 35.05,26.29 U3.7 | R5.2 33.48,28.89 U3.8 33.78,35.81 v34.04,36.07
  Top 0.305: RXLED.A v2.51,28.19 TXLED.A
  Top 0.406: U2.5 v27.5,8.32 | 27.49,13.4 v27.56,13.46 | U3.7 U3.8 | FB1.1 48.9,19.77 48.9,16.64 49.28,16.26 v49.28,7.11 | C14.2 44.89,36.13 v44.45,36.58 | C9.2 43.49,28.64 42.04,27.18 39.62,27.18 39.12,26.67 39.12,16 40.89,14.22 v40.89,9.53
  Top 0.61: X2.1 63.88,22.86 63.37,23.37 62.48,23.37 59.69,26.16 v59.69,26.67 59.69,29.34 59.32,29.71 C6.2 | 12.95,41.91 13.21,42.16 14.99,42.16 15.49,42.67 v16.26,42.67 | C3.2 27.49,8.44 27.43,8.38
  Top 0.813: 27.49,13.4 C13.1 C3.2 | v67.31,17.02 67.31,21.45 X2.1
  Bottom 0.254: 9.78,23.24 13.21,19.81 20.95,19.81 27.3,13.46 v27.56,13.46 | 12.7,31.46 v10.58,31.46 8.1,31.46 4.83,28.19 | 12.7,31.46 18.38,31.46 18.99,30.86 v19.05,30.86 | 12.7,31.46 12.7,42.42 v11.94,43.18
  Bottom 0.305: 9.78,23.24 4.83,28.19 v2.51,28.19
  Bottom 0.406: v49.28,7.11 49.28,8.32 | v44.45,36.58 44.45,36.32 | v40.89,9.53 40.89,8.32
  Bottom 0.61: v16.26,42.67 16.26,39.12 20.32,35.05 29.21,35.05 30.23,36.07 v34.04,36.07 43.31,36.07 43.56,36.32 44.45,36.32 45.09,36.32 45.85,35.56 51.31,35.56 55.12,39.37 62.23,39.37 63.75,37.85 63.75,33.27 61.85,31.37 61.85,28.83 v59.69,26.67
  Bottom 0.813: v27.5,8.32 30.23,8.32 | 30.23,8.32 35.31,8.32 | 35.31,8.32 40.89,8.32 49.28,8.32 62.93,8.32 67.31,12.7 v67.31,17.02 | POWER.4 35.56,8.06 35.31,8.32 | POWER.2 30.48,8.06 30.23,8.32
!RESET  (via drill 0.5)
  Top 0.254: RESET.B 10.51,47.4 v13.08,44.83 | v57.66,24.64 57.15,24.13 57.15,16.51 v57.4,16.26 57.9,16.26 X2.10 | v39.88,12.32 39.88,14.35 38.48,15.75 38.48,34.04 39.88,35.43 R3.1 41.09,36.77 41.4,37.08 v41.4,40.89 | POWER.3 v33.02,12.45
  Top 0.305: RESET.B' RESET.B
  Bottom 0.254: v14.61,35.31 14.61,44.45 | 14.61,44.45 14.22,44.83 v13.08,44.83 | ICSP.5 62.61,24.64 v57.66,24.64 | v33.02,12.45 38.1,12.45 38.23,12.32 v39.88,12.32 48.9,12.32 52.58,16 57.15,16 v57.4,16.26 | 14.61,44.45 21.84,44.45 25.4,40.89 v41.4,40.89
+5V  (via drill 0.5)
  Top 0.406: C2.2 21.84,13.84 | v37.97,13.97 38.1,13.84 v38.1,9.4
  Top 0.61: 21.84,10.16 21.84,9.14 22.67,8.32 U2.1 24.32,8.32 24.64,8 24.64,6.6 24.45,6.42 U2.3 | 21.84,10.16 21.84,13.84 21.84,14.69 | v23.11,10.16 21.84,10.16 | v38.1,9.4 POWER.5
  Top 0.813: U1.2 18.76,18.44 PC2.+ 19.81,17.39 v19.81,16.76 21.84,14.73 21.84,14.69 | TR1.2 11.68,22.99 v9.65,20.95
  Bottom 0.406: ICSP.2 67.56,28.83 67.56,24.13 66.29,22.86 61.21,22.86 55.37,17.02 52.32,17.02 49.28,13.97 v37.97,13.97
  Bottom 0.61: v19.81,16.76 18.41,18.16 11.81,18.16 11.68,18.29 v11.56,18.29 | v38.1,9.4 29.46,9.4 28.7,10.16 v23.11,10.16
  other vias: 11.56,19.68 11.43,16.76 9.78,15.88 11.3,15.37 10.03,14.73
  pour Bottom (isolate 0.254, no thermals): 0.89,29.72 10.79,29.72 10.79,21.59 12.7,19.68 12.7,16.13 9.27,12.7 0.89,12.7
  pour Top (no thermals): 1.27,12.7 1.27,29.84 10.16,29.84 10.29,22.1 12.95,19.43 12.95,16.13 10.16,13.34 10.16,12.7
A0  (via drill 0.5)
  Top 0.254: U$1.3 49.3,27.21 47.75,25.65 47.75,25.02 v47.5,24.77 | AD.1 50.8,3.56 47.75,6.6 47.75,18.92 v47.88,19.05
  Bottom 0.254: v47.5,24.77 47.5,19.56 47.88,19.18 v47.88,19.05
A1
  Top 0.254: U$1.7 51.3,10.93 53.34,8.89 AD.2
A2
  Top 0.254: U$1.8 51.8,12.46 55.88,8.38 AD.3
A3  (via drill 0.5)
  Top 0.254: U$1.9 52.3,13.48 v53.59,12.19 | v58.42,11.94 AD.4
  Bottom 0.254: v53.59,12.19 58.17,12.19 v58.42,11.94
A4  (via drill 0.5)
  Top 0.254: U$1.10 52.8,14.51 v53.34,13.97 | v60.2,13.46 60.96,12.7 AD.5
  Bottom 0.254: v53.34,13.97 59.69,13.97 v60.2,13.46
A5  (via drill 0.5)
  Top 0.254: U$1.47 47.03,29.5 46.23,28.7 v46.23,26.92 | v46.74,18.03 v46.74,5.84
  Bottom 0.254: v46.74,5.84 47.24,5.33 62.74,5.33 63.5,4.57 AD.6 | v46.23,26.92 46.23,18.54 v46.74,18.03
AREF  (via drill 0.5)
  Top 0.254: U$1.4 49.8,26.94 48.39,25.53 48.39,24.38 47.5,23.5 47.12,23.5 46.35,22.73 C4.2 46.03,21.4 45.09,20.45 v42.8,20.45
  Top 0.305: IOH.3 24.13,50.55 v24.13,22.86
  Bottom 0.254: 26.92,20.57 26.42,20.57 v24.13,22.86
  Bottom 0.305: 26.92,20.57 42.55,20.57 42.67,20.45 v42.8,20.45
AVCC
  Top 0.254: U$1.6 50.8,26.51 50.02,25.73 C10.2 49.77,25.26 48.9,24.38 48.9,23.1 FB1.2 50.16,20.4 C8.2
D0  (via drill 0.5)
  Top 0.254: U$1.16 55.99,30.5 v56.77,29.72 | IOL.8 63.5,48.51 62.74,47.75 62.74,34.8 62.36,34.42 v62.36,34.16
  Bottom 0.254: v56.77,29.72 57.91,29.72 61.09,32.89 61.09,33.53 61.72,34.16 v62.36,34.16
D1  (via drill 0.5)
  Top 0.254: U$1.15 55.34,30 56.13,29.21 56.13,28.96 v56.64,28.45 | IOL.7 60.96,49.02 62.23,47.75 62.23,35.31 61.47,34.54 61.47,33.78 61.98,33.27 v61.98,33.02
  Bottom 0.254: v56.64,28.45 57.4,28.45 v61.98,33.02
D2
  Top 0.254: U$1.23 57.11,34 59.69,36.58 59.69,48.51 58.42,49.78 IOL.6
D3  (via drill 0.5)
  Top 0.254: U$1.14 55.08,29.5 55.63,28.96 55.63,27.94 v56.39,27.18 | v57.66,37.08 57.66,47.5 55.88,49.28 IOL.5
  Bottom 0.254: v56.39,27.18 55.63,27.94 55.63,33.53 57.66,35.56 v57.66,37.08
D4  (via drill 0.5)
  Top 0.254: U$1.13 55.12,28.41 55.12,26.92 55.63,26.42 v55.63,26.16 | v56.64,36.07 56.64,47.12 53.34,50.42 IOL.4
  Bottom 0.254: v55.63,26.16 55.12,26.67 55.12,34.04 56.64,35.56 v56.64,36.07
D5  (via drill 0.5)
  Top 0.254: U$1.24 56.6,34.5 58.93,36.83 58.93,47.5 v57.78,48.64
  Bottom 0.254: v57.78,48.64 57.91,48.77 51.05,48.77 50.8,49.02 IOL.3
D6
  Top 0.254: U$1.29 51.8,41.41 48.26,44.96 IOL.2
D7
  Top 0.254: U$1.30 51.3,40.9 45.97,46.23 45.97,50.55 IOL.1
D8  (via drill 0.5)
  Top 0.254: U$1.11 53.3,26.71 v53.59,26.42 | v54.61,36.07 v54.61,45.21 | v43.43,46.99 41.66,48.77 IOH.10
  Bottom 0.254: v53.59,26.42 53.59,35.05 v54.61,36.07 | v54.61,45.21 52.83,46.99 v43.43,46.99
D9  (via drill 0.5)
  Top 0.254: U$1.12 54.61,27.47 v54.61,25.15 | v55.63,37.08 55.63,46.86 v54.61,47.88
  Bottom 0.254: IOH.9 39.12,48.77 40.01,47.88 v54.61,47.88 | v54.61,25.15 54.61,34.54 55.63,35.56 v55.63,37.08
D10  (via drill 0.5)
  Top 0.254: U$1.27 52.8,42.95 51.82,43.94 v51.31,43.94 | v37.59,43.94 36.58,44.96 IOH.8
  Bottom 0.254: v51.31,43.94 v37.59,43.94
D11  (via drill 0.5)
  Top 0.254: U$1.25 53.8,44.75 52.7,45.85 v52.07,45.85
  Bottom 0.254: v52.07,45.85 35.94,45.85 34.04,47.75 IOH.7
D12  (via drill 0.5)
  Top 0.254: U$1.28 52.3,42.18 v51.82,42.67 | v31.5,43.69 IOH.6
  Bottom 0.254: v51.82,42.67 32.51,42.67 v31.5,43.69
D13  (via drill 0.5)
  Top 0.254: 6.99,31.18 6.99,30.35 8.09,29.25 R2.8 | U$1.26 53.3,43.85 v52.58,44.58
  Top 0.305: 6.99,31.18 v6.99,34.16
  Bottom 0.254: v52.58,44.58 52.2,44.96 32.51,44.96 32.51,45.09 29.59,48.01 28.96,48.01 IOH.5
  Bottom 0.305: v6.99,34.16 6.48,34.67 6.48,41.02 13.46,48.01 28.96,48.01
D+  (via drill 0.5)
  Top 0.254: U$1.34 49.3,36.55 v48.51,37.34 | v21.59,37.47 21.46,37.34 7.49,37.34 6.73,38.1
  Top 0.305: X3.D+ 6.73,38.1
  Bottom 0.254: v48.51,37.34 47.88,37.97 22.1,37.97 v21.59,37.47
D-  (via drill 0.5)
  Top 0.254: 6.93,38.75 7.33,38.35 v20.57,38.35 | U$1.33 49.8,37.57 v48.77,38.61
  Top 0.305: X3.D- 6.93,38.75
  Bottom 0.254: v48.77,38.61 48.64,38.48 20.7,38.48 v20.57,38.35
FLASH_CS  (via drill 0.5)
  Top 0.254: U$1.22 54.56,33.53 57.66,33.53 60.58,36.45 v60.58,38.1 | U3.1 33.02,22.72 33.02,26.1 R5.1 31.43,26.99 30.99,27.43 30.99,29.72 31.75,30.48 v31.75,31.62
  Bottom 0.254: v60.58,38.1 55.37,38.1 52.07,34.8 48.77,34.8 46.23,32.26 43.43,32.26 43.18,32.51 38.35,32.51 37.47,31.62 v31.75,31.62
FLASH_MISO  (via drill 0.5)
  Top 0.254: U$1.48 47.54,29 47.54,28.24 v47.24,27.94 | v35.05,24.77 U3.2
  Bottom 0.254: v47.24,27.94 44.32,27.94 42.8,26.42 35.56,26.42 35.05,25.91 v35.05,24.77
FLASH_MOSI  (via drill 0.5)
  Top 0.254: U$1.37 46.78,34.5 46.23,35.05 44.45,35.05 v44.45,35.18 | U3.5 37.59,32.89 37.97,33.27 v37.97,34.92
  Bottom 0.254: v44.45,35.18 43.31,35.18 43.05,34.92 v37.97,34.92
FLASH_SCK  (via drill 0.5)
  Top 0.254: U3.6 36.32,32.89 v36.83,33.4 | U$1.38 45.63,34 v45.47,34.16
  Bottom 0.254: v36.83,33.4 37.47,33.4 38.1,34.04 43.18,34.04 43.43,34.29 45.34,34.29 v45.47,34.16
GND  (via drill 0.5)
  Top 0.254: U$1.5 50.3,29.73 50.8,30.23 | v52.58,31.75 52.83,31.5 U$1.18 57.4,31.5 v57.78,31.11 | U$1.42 49.53,32 50.04,31.5 49.78,31.5 v49.53,31.75 | U$1.35 48.8,33.75 49.15,33.4 v50.29,33.4 | v59.94,34.29 60.83,35.18 60.83,35.69 61.59,36.45 61.59,38.73 61.21,39.12 61.21,39.37
  Top 0.305: L.C 0.64,31.62 | 11.68,48.39 v10.41,49.66 | v20.45,20.7 19.3,19.56 14.86,19.56
  Top 0.406: X3.GND 6.27,35.63 | R2.5 8.09,23.88 | 8.09,23.88 8.09,22.27 6.87,21.05 SW1.A | v6.6,23.88 8.09,23.88 | 50.3,29.73 50.29,29.73 v50.29,30.1
  Top 0.61: 6.27,35.63 9.21,35.63 v9.27,35.56 | 1.14,30.86 v1.02,30.73
  Bottom 0.406: GROUND1.2 8.51,44.7 | v1.02,30.73 1.02,27.94 3.3,25.65 4.83,25.65 v6.6,23.88
  Bottom 0.61: 6.35,31.5 7.37,32.51 9.65,32.51
  other vias: 17.27,8.13 2.03,49.78 23.5,19.94 17.27,16.13 6.35,46.48 12.06,49.66 18.8,15.75 11.18,40.26 19.43,23.24 17.14,6.35 19.18,4.83 17.65,4.95 17.91,21.46 19.05,29.08 26.42,36.7 17.4,39.75 16.38,36.45 51.82,33.4 51.82,30.1 51.05,31.75 46.23,41.15 37.47,23.88 34.54,16 40.13,29.72 50.29,16.76 45.72,15.11 44.45,19.3 50.04,21.84 53.98,23.88 56.01,19.68 25.15,44.2 25.02,29.84 26.92,23.11 34.29,4.57 31.75,4.7 24,11.18 29.08,4.7 28.96,16 27.43,42.93 17.02,46.48 60.83,40.89 44.45,41.15 58.29,26.29 60.45,30.1 61.21,26.42 17.65,43.18 36.83,4.7 40.13,25.15 34.04,26.54 30.1,29.84
  pour Bottom (isolate 0.254, rank 2): 0.25,53.34 68.83,53.34 68.83,37.85 69.09,37.85 68.58,9.91 46.23,9.91 45.97,9.4 45.47,-0.25 0,0 0,32.38 8.89,32.38 8.89,43.69 0.64,43.69
  pour Top (isolate 0.254, rank 2): 0.76,53.59 69.34,53.59 68.83,14.73 48.51,14.48 48.51,-0.25 0,0 0.38,32.38 8.89,30.23 8.89,43.69 0.51,43.69
MISO
  Top 0.254: U$1.21 60.85,33 ICSP.1
MOSI
  Top 0.254: U$1.19 60.33,32 61.47,30.86 61.47,29.46 61.72,29.21 61.72,27.43 62.48,26.67 64.64,26.67 ICSP.4
N$1
  Top 0.254: L.A 6.39,29.97 R2.1
N$2  (via drill 0.5)
  Top 0.305: FB2.1 3.11,45.78 v3.3,45.59
  Bottom 0.406: GROUND1.1 4.06,44.7 3.3,45.47 v3.3,45.59
N$3
  Top 0.254: ON.C 5.02,24.64 R2.4
N$4
  Top 0.254: U$1.1 48.3,27.73 45.66,25.08 42.62,25.08 C5.1 | C5.1 41.66,22.43 Y1.P$1 | 41.66,24.26 C5.1
N$5
  Top 0.254: RXLED.C 4.61,28.8 5.71,27.69 6.37,27.69 R2.2
N$6
  Top 0.254: U$1.2 48.8,27.47 45.47,24.13 C7.1 43.51,22.66 Y1.P$4
N$7
  Top 0.254: TXLED.C 6.37,26.92 R2.3
N$8
  Top 0.254: U$1.40 46.46,33 46.23,32.77 45.72,32.77 45.47,32.51 42.99,32.51 C11.2
  Top 0.406: C11.2 R3.2
N$9
  Top 1.016: D1.A 11.35,13.39 10.41,12.45 10.41,8.24 X5.PWR
N$10
  Top 0.254: X3.ID 6.24,37.45 7.11,36.58 10.03,36.58 12.7,33.91 R11.1 12.7,32.91 12.7,32.26 13.34,31.62 15.31,31.62 R1.5 | IC3.2 15.24,29.03 15.24,30.86 16.04,30.86 R1.5 | 15.88,31.06 R1.5
  Top 0.305: IC3.2 IC3.1
N$11
  Top 0.254: R1.7 R1.8 16.04,27.6 14.73,26.29 | TR1.3 12.7,24.28 12.7,23.5 13.08,23.11 14.48,23.11 14.73,23.37 14.73,26.29 | IC3.4 12.18,29.98 12.83,29.34 12.83,27.69 13.21,27.3 13.97,27.3 14.73,26.54 14.73,26.29
N$13  (via drill 0.5)
  Top 0.305: 12.38,9.19 12.19,9.38 v12.19,10.92
  Top 0.406: SW1.B 6.59,18.05 7.62,17.02 7.62,15.11 JP1.1
  Top 0.61: 12.38,9.19 12.89,9.19 | R7.1 12.89,9.19 | 12.89,9.19 T2.3
  Bottom 0.305: v12.19,10.92 9.91,13.21 9.53,13.21 JP1.1
N$15
  Top 0.61: D1.C 15.59,10.46 14.91,9.78 T2.2 14.79,9.15 R7.2
NEOPIX/SWCLK  (via drill 0.5)
  Top 0.254: U$1.45 45.99,30.5 v45.47,29.97 | X2.4 62.48,17.15 62.48,12.7 | 62.48,12.7 v62.48,10.29 | v30.99,10.92 30.99,24.89 28.96,26.92 v28.96,27.69 | R4.1 65.85,13.53 65.28,12.95 62.74,12.95 62.48,12.7 | v22.86,27.69 23.11,27.69 23.62,28.19 23.62,39.12 22.35,40.39 18.29,40.39 17.27,41.4 14.18,41.4 LED1.1
  Bottom 0.254: v30.99,10.92 31.5,10.41 41.91,10.41 42.04,10.29 v62.48,10.29 62.61,10.29 65.91,13.59 TP1.P$1 | v45.47,29.97 44.2,29.97 42.67,28.45 29.72,28.45 v28.96,27.69 v22.86,27.69
PA28_USB_HOST_EN  (via drill 0.5)
  Top 0.254: R11.2 15.39,32.92 v16,33.53 | U$1.41 46.72,32.5 46.48,32.26 45.97,32.26 45.72,32 40.26,32 v39.88,31.62
  Bottom 0.254: v16,33.53 19.3,33.53 22.1,30.73 37.34,30.73 38.23,31.62 v39.88,31.62
RXLED/SWDIO  (via drill 0.5)
  Top 0.254: R2.7 9,27.7 v9.4,27.3 | U$1.46 46.76,30 44.96,28.19 v44.96,26.92 | v63.75,14.22 63.88,14.35 X2.2 | v26.67,26.16 28.96,23.88 v28.96,18.8 | v44.96,11.43 44.96,12.95 42.8,15.11 v42.8,18.03
  Bottom 0.254: v9.4,27.3 10.54,26.16 v26.67,26.16 | v44.96,26.92 44.96,26.54 45.47,26.04 45.47,18.8 44.7,18.03 v42.8,18.03 29.72,18.03 v28.96,18.8 | TP2.P$1 65.15,21.21 65.15,20.95 64.39,20.19 64.39,18.8 64.01,18.41 64.01,14.48 v63.75,14.22 62.74,15.24 52.83,15.24 48.77,11.18 45.21,11.18 v44.96,11.43
SCK
  Top 0.254: U$1.20 60.59,32.5 61.98,31.11 61.98,29.72 63.37,28.32 ICSP.3
SCL  (via drill 0.5)
  Top 0.254: U$1.32 50.3,39.1 v49.78,39.62 | v18.8,41.91 IOH.1
  Bottom 0.254: v18.8,41.91 21.72,38.99 47.12,38.99 47.75,39.62 v49.78,39.62
SDA  (via drill 0.5)
  Top 0.254: U$1.31 50.8,40.13 v50.04,40.89 | v21.59,42.67 21.46,42.8 21.46,49.63 21.34,49.76 IOH.2
  Bottom 0.254: v21.59,42.67 24.77,39.5 46.86,39.5 48.26,40.89 v50.04,40.89
TXLED  (via drill 0.5)
  Top 0.254: R2.6 8.4,26.91 v9.53,25.78 | U$1.39 46.2,33.5 45.97,33.27 44.58,33.27 v44.45,33.4 | v21.08,25.15 21.08,30.99 v22.1,32
  Bottom 0.254: v21.08,25.15 10.16,25.15 v9.53,25.78 | v22.1,32 22.61,32.51 37.47,32.51 38.23,33.27 44.32,33.27 v44.45,33.4
USBVCC
  Top 0.813: F2.2 8.76,29.84 10.54,28.07 10.54,26.8 10.92,26.42 13.46,26.42 13.72,26.16 TR1.1
USHIELD
  Top 0.406: FB2.2 1.78,42.34 X3.SPRT@3
  pour Bottom: 0.13,43.05 0.13,32.89 6.35,32.89 6.35,43.05
  pour Top: 0.13,43.05 0.13,32.89 6.35,32.89 6.35,43.05
VBUS  (via drill 0.5)
  Top 0.406: X3.VBUS 7.01,39.4 v7.62,40.01
  Top 0.813: v10.41,33.78 10.39,33.81 F2.1
  Bottom 0.813: v7.62,40.01 7.62,35.56 9.4,33.78 v10.41,33.78
VDDCORE
  Top 0.254: U$1.43 44.45,31.5 43.69,30.73 43.42,30.73 | 43.31,30.73 43.42,30.73 | 43.42,30.73 C1.1
VIN  (via drill 0.5)
  Top 0.254: C12.1 15.94,23.94 17.74,25.74 R1.1
  Top 0.406: 15.51,20.7 15.55,20.74 U1.3
  Top 0.61: 13.59,14.86 13.59,19.81 14.48,20.7 15.51,20.7 | 13.59,14.86 17.16,14.86 18.5,13.51 PC1.+ | 13.59,14.86 13.59,11.3 T2.1 | C12.1 15.94,20.75 U1.3 | POWER.8 45.72,3.81 43.43,6.1 43.43,10.41 v42.67,11.18
  Top 0.813: v20.57,13.59 20.5,13.51 18.5,13.51
  Bottom 0.61: v42.67,11.18 32.51,11.18 31.5,12.19 30.48,12.19 29.84,11.56 26.16,11.56 25.53,12.19 22.35,12.19 20.95,13.59 v20.57,13.59

### Text on the board
tNames: SCL | SDA | AREF | GND | 1 | ANALOG IN | IOREF | RESET | 3V3 | 5V | GND | VIN | A0 | A1 | A2 | A3 | A4 | A5
214bmp: D:/SmartProjects/Snc/a4_bn_logo2.bmp